# Altium schematic sheet mixer.SchDoc
size A4
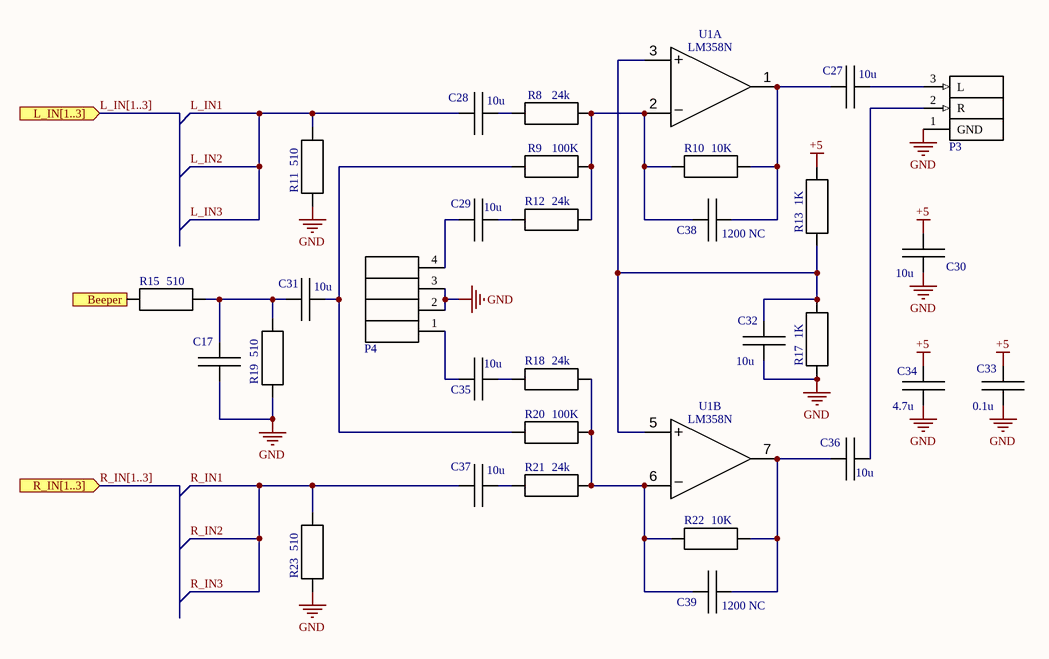
[diagram p0: mixer.SchDoc]

## Parts
C17  Cap  [CAP 4x2.5]  (value not drawn)
C27  10u  [CAP 5.5x3.15]
C28  10u  [CAP 5.5x3.15]
C29  10u  [CAP 5.5x3.15]
C30  10u  [CAP 5.5x3.15]
C31  10u  [CAP 5.5x3.15]
C32  10u  [CAP 5.5x3.15]
C33  0.1u  [CAP 4x2.5]
C34  4.7u  [CAP 5.5x3.15]
C35  10u  [CAP 5.5x3.15]
C36  10u  [CAP 5.5x3.15]
C37  10u  [CAP 5.5x3.15]
C38  1200 NC  [CAP 5.5x3.15]
C39  1200 NC  [CAP 5.5x3.15]
P3  3.5mm audio socket  [ST-111]  (value not drawn)
P4  Header 4  [PLS4]  (value not drawn)
R8  24k  [Axial Res 0.25]
R9  100K  [Axial Res 0.25]
R10  10K  [Axial Res 0.25]
R11  510  [Axial Res 0.25]
R12  24k  [Axial Res 0.25]
R13  1K  [Axial Res 0.25]
R15  510  [Axial Res 0.25]
R17  1K  [Axial Res 0.25]
R18  24k  [Axial Res 0.25]
R19  510  [Axial Res 0.25]
R20  100K  [Axial Res 0.25]
R21  24k  [Axial Res 0.25]
R22  10K  [Axial Res 0.25]
R23  510  [Axial Res 0.25]
U1  LM358N  [DIP8]  (parts A,B of 2)

## Ports
Beeper (in), L_IN[1..3] (in), R_IN[1..3] (in)

## Nets
+5: C30.2 C33.2 C34.2 R13.1 U1.8(V+)
GND: C17.1 C30.1 C32.1 C33.1 C34.1 P3.1(GND) P4.2 P4.3 R11.2 R17.2 R19.2 R23.2 U1.4(GND)
Beeper: R15.2 ; port Beeper
L_IN1: C28.1 R11.1  [also labelled L_IN2, L_IN3]
R_IN1: C37.1 R23.1  [also labelled R_IN2, R_IN3]
NetC17_2: C17.2 C31.1 R15.1 R19.1
NetC27_1: C27.1 C38.1 R10.1 U1.1(Aout)
NetC27_2: C27.2 P3.3(L)
NetC28_2: C28.2 R8.2
NetC29_1: C29.1 P4.4
NetC29_2: C29.2 R12.2
NetC31_2: C31.2 R9.2 R20.2
NetC32_2: C32.2 R13.2 R17.1 U1.3(A+) U1.5(B+)
NetC35_1: C35.1 P4.1
NetC35_2: C35.2 R18.2
NetC36_1: C36.1 C39.1 R22.1 U1.7(Bout)
NetC36_2: C36.2 P3.2(R)
NetC37_2: C37.2 R21.2
NetC38_2: C38.2 R8.1 R9.1 R10.2 R12.1 U1.2(A-)
NetC39_2: C39.2 R18.1 R20.1 R21.1 R22.2 U1.6(B-)

## Buses and harness runs
bus L_IN[1..3] = port L_IN[1..3]
bus R_IN[1..3] = port R_IN[1..3]

## Notes on the sheet
- (in symbol LM358N, part A) +; −
- (in symbol LM358N, part B) +; −

## Library data of the parts
C17 C27-C39 = Cap: Murata ceramic capacitor
P4 = PLS4
R8-R13 R15 R17-R23 = Axial Resistor 0.25